# Altium schematic sheet JTAG_Connector.SchDoc: JTAG Connector
size A; DocumentNumber: 9; SheetNumber: 9; SheetTotal: 46
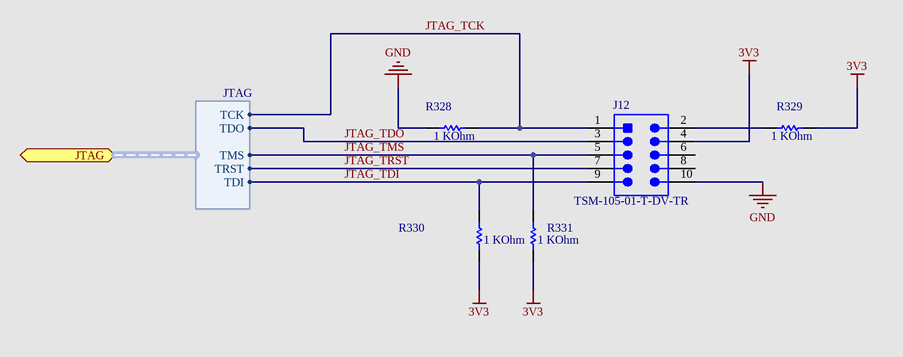
[diagram p0: JTAG_Connector.SchDoc]

## Parts
J12  TSM-105-01-T-DV-TR  [SMTC-TSM-105-01-T-DV_V]
R328  Resistance: 1 KOhm  [RESC1005X40X25LL05T05]  (hidden comment: ERJ-2RKF1001X)
R329  Resistance: 1 KOhm  [RESC1005X40X25LL05T05]  (hidden comment: ERJ-2RKF1001X)
R330  Resistance: 1 KOhm  [RESC1005X40X25LL05T05]  (hidden comment: ERJ-2RKF1001X)
R331  Resistance: 1 KOhm  [RESC1005X40X25LL05T05]  (hidden comment: ERJ-2RKF1001X)

## Ports
JTAG (harness JTAG)

## Harnesses
JTAG: TDI, TDO, TCK, TMS, TRST

## Nets
3V3: J12.4 R329.2 R330.1 R331.1
GND: J12.10 R328.1
JTAG_TCK: J12.1 R328.2 ; port JTAG.TCK
JTAG_TDI: J12.9 R330.2 ; port JTAG.TDI
JTAG_TDO: J12.3 ; port JTAG.TDO
JTAG_TMS: J12.5 R331.2 ; port JTAG.TMS
JTAG_TRST: J12.7 ; port JTAG.TRST
NetJ12_2: J12.2 R329.1

Not connected (* = marked no-connect by the designer): J12 6 8

## Notes on the sheet
- Title
- Size:
- Date:
- A
- Number:
- Time:
- Revision:
- Sheet
- of
- File:

## Library data of the parts
J12 = CMP-1707-00003-3: Male Header, Pitch 2.54 mm, 2 x 5 Position, Height 9.65 mm, -55 to 105 degC, RoHS, Tape and Reel; Max Operating Temperature: 105 degC; ComponentLink1URL: http://www.samtec.com/; Min Operating Temperature: -55 degC; ComponentLink2URL: http://suddendocs.samtec.com/catalog_english/tsm.pdf; ComponentLink2Description: Datasheet; Mounting Technology: Surface Mount; Pins: 10; DatasheetVersion: Rev. 31DEC15; PackageDescription: Male Header, Pitch 2.54 mm, 2 x 5 Position, Height 9.65 mm; Height: 9.65 mm; ComponentLink3URL: http://suddendocs.samtec.com/prints/tsm-dv-footprint.pdf; Packaging: Tape and Reel; Radiation Hardening: No; ComponentLink3Description: Package Specification; RoHSCompliant: True; REACH SVHC: No SVHC; Length: 12.7 mm; PartNumber: TSM-105-01-T-DV-TR; Mount: Surface Mount; ComponentLink1Description: Manufacturer URL
R328-R331 = CMP-2002-00606-3: Chip Resistor, 1 KOhm, +/- 1%, 100 mW, -55 to 155 degC, 0402 (1005 Metric), RoHS, Tape and Reel; Manufacturer: Basic Passives; Voltage Rating: 50 V; Power Rating: 100 mW; Case\/Package: 0402; PartNumber: ERJ-2RKF1001X; Width: 0.5 mm; ComponentLink1URL: http://www.panasonic.com/; Length: 1 mm; Min Operating Temperature: -55 degC; PackageDescription: 2-Pin Surface Mount Device, Body 1 x 0.5 mm; Case Code (Metric): 1005; Height: 0.35 mm; ComponentLink1Description: Manufacturer URL; Mounting Technology: Surface Mount; Tolerance: 1%; Packaging: Tape and Reel; Package Quantity: 10000; REACH SVHC: Yes; Max Operating Temperature: 155 degC; Mount: Surface Mount; RoHSCompliant: true; Case Code (Imperial): 0402; DatasheetVersion: 04/2015; Radiation Hardening: No; Pins: 2; ComponentLink2Description: Datasheet; PackageReference: 0402; ComponentLink2URL: http://industrial.panasonic.com/cdbs/www-data/pdf/RDA0000/AOA0000C86.pdf